# Altium project Twitch_Switch_PCB.PrjPcb (part 2 of 3)

## Sheet Sheet3_Power.SchDoc
size A; SheetNumber: 3; SheetTotal: 6
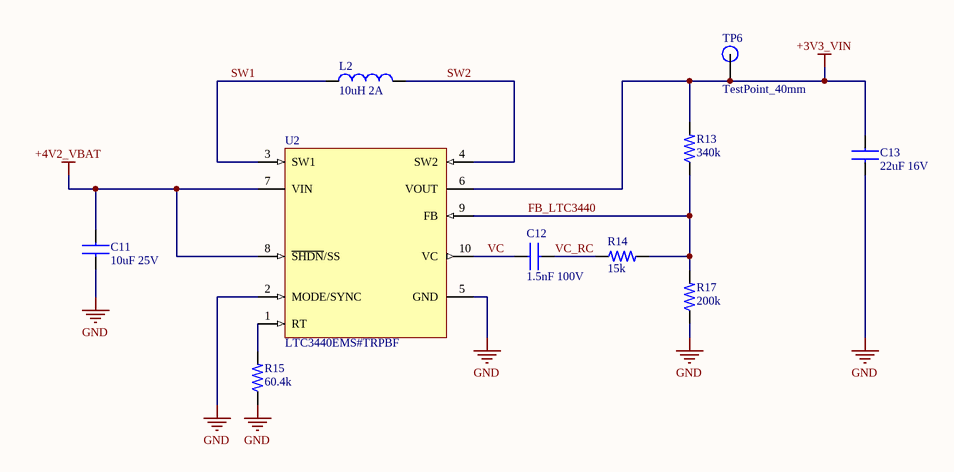
[diagram p1: Sheet3_Power.SchDoc]

### Parts
C11  10uF 25V  [CAP_0805_1_4MM]
C12  1.5nF 100V  [CAP_0805_1_4MM]
C13  22uF 16V  [CAP_0805_1_4MM]
L2  10uH 2A  [IND_4x4MM]
R13  340k  [RES_0603_1608X06]
R14  15k  [RES_0603_1608X06]
R15  60.4k  [RES_0603_1608X06]
R17  200k  [RES_0603_1608X06]
TP6  TestPoint_40mm  [TP_40MM]
U2  LTC3440EMS#TRPBF  [10-MSOP_3x3]

### Nets
+3V3_VIN: C13.1 R13.2 TP6.1 U2.6(VOUT)
+4V2_VBAT: C11.1 U2.7(VIN) U2.8(~{SHDN}/SS)
GND: C11.2 C13.2 R15.1 R17.1 U2.2(MODE/SYNC) U2.5(GND)
FB_LTC3440: R13.1 R14.2 R17.2 U2.9(FB)
SW1: L2.1 U2.3(SW1)
SW2: L2.2 U2.4(SW2)
VC: C12.2 U2.10(VC)
VC_RC: C12.1 R14.1
NetR15_2: R15.2 U2.1(RT)

### Library data of the parts
C11 = GRM21BR61E106KA73K: CAP CER 10UF 25V X5R 0805; Manufacturer: Murata; Tolerance: 10%; Supplier 1: Digi-Key; Manufacturer Part Number: GRM21BR61E106KA73K; RoHS: Yes; Category: Ceramic Capacitors; Stock 1: 101639; Pricing 1: 1=0.23000, 10=0.15700, 50=0.09400, 100=0.07940, 500=0.05434, 1000=0.04807, 2500=0.04598, 5000=0.04180 (USD); Mount: Surface Mount; Case/Package: 0805; Weight: 0.000335oz; Min Operating Temperature: -55°C; Max Operating Temperature: 85°C; Packaging: Tape and Reel; Capacitance: 10uF; Voltage Rating: 25V; Package Quantity: 10000; Dielectric: X5R; Voltage Rating (DC): 25V; Length: 0.079inch; Width: 0.049inch; Thickness: 0.055inch; RoHS Compliant: Yes; ComponentLink1URL: http://www.mouser.com/ds/2/281/c02e-2905.pdf?src-supplier=Mouser; ComponentLink1Description: http://www.mouser.com/ds/2/281/c02e-2905.pdf?src-supplier=Mouser; ComponentLink2URL: http://search.murata.co.jp/Ceramy/image/img/A01X/G101/ENG/GRM21BR61E106KA73-01.pdf?src-supplier=Digi-Key; ComponentLink2Description: http://search.murata.co.jp/Ceramy/image/img/A01X/G101/ENG/GRM21BR61E106KA73-01.pdf?src-supplier=Digi-Key; ComponentLink3URL: https://search.murata.co.jp/Ceramy/image/img/A01X/G101/ENG/GRM21BR61E106KA73-01.pdf?src-supplier=Digi-Key; ComponentLink3Description: https://search.murata.co.jp/Ceramy/image/img/A01X/G101/ENG/GRM21BR61E106KA73-01.pdf?src-supplier=Digi-Key
C12 = C0805C152J1RECAUTO: Cap Cer 0805 1.5NF 100V X7R 5%
C13 = CL21A226MOCLRNC: CAP CER 22UF 16V X5R 0805; Manufacturer: Samsung; Tolerance: 20%; Supplier 1: Digi-Key; Manufacturer Part Number: CL21A226MOCLRNC; RoHS: Yes; Category: Ceramic Capacitors; Stock 1: 182418; Pricing 1: 1=0.35000, 10=0.23900, 50=0.15920, 100=0.13540, 500=0.09554, 1000=0.08360 (USD); Mount: Surface Mount; Case/Package: 0805; Case Code (Metric): 2012; Case Code (Imperial): 0805; Min Operating Temperature: -55°C; Max Operating Temperature: 85°C; Packaging: Tape and Reel; Capacitance: 22uF; Voltage Rating: 16V; Length: 0.079inch; Width: 0.049inch; Thickness: 0.037inch; ComponentLink1URL: http://www.samsungsem.com/kr/support/product-search/mlcc/CL21A226MOCLRNC.jsp?src-supplier=Digi-Key; ComponentLink1Description: http://www.samsungsem.com/kr/support/product-search/mlcc/CL21A226MOCLRNC.jsp?src-supplier=Digi-Key
L2 = TYA4020100M-10: FIXED IND 10UH 2A 220 MOHM SMD; Manufacturer: Laird; Supplier 1: Digi-Key; Manufacturer Part Number: TYA4020100M-10; RoHS: No
R13 = CRCW0603340KFKEA: VISHAY - CRCW0603340KFKEA - SMD Chip Resistor, 0603 [1608 Metric], 340 kohm, CRCW e3 Series, 75 V, Thick Film, 100 mW; Resistance: 340kR; Tolerance: 1%; Temperature Coefficient: 100ppm/°C; Max Power Dissipation: 100mW; Voltage Rating: 75V; Supplier 1: Digi-Key; Manufacturer: Vishay; Manufacturer Part Number: CRCW0603340KFKEA; RoHS: Yes; Category: Chip SMD Resistors; Stock 1: 9256; Pricing 1: 1=0.10000, 10=0.03400, 100=0.01390, 1000=0.00624, 2500=0.00542 (USD); Case/Package: 0603; Number of Pins: 2; Weight: 7.1E-05oz; Case Code (Metric): 1608; Case Code (Imperial): 0603; Contact Plating: Tin; Size Code: 0603; Min Operating Temperature: -55°C; Max Operating Temperature: 155°C; Packaging: Tape and Reel; Package Quantity: 10; Resistor Type: Thick Film; Number of Terminations: 2; Features: Automotive AEC-Q200; Series: CRCW; Power Rating: 100mW; Termination: SMD/SMT; Voltage Rating (DC): 75V; Resistance Tolerance: 1%; Construction: Rectangular; Length: 1.55mm; Width: 0.033inch; Height: 0.02inch; Depth: 0.85mm; Radiation Hardening: No; Lead Free: Lead Free; RoHS Compliant: Yes; REACH SVHC: Unknown; Military Standard: Not; ComponentLink1URL: https://datasheet.ciiva.com/2466/dcrcwe3-2466626.pdf?src-supplier=Digi-Key; ComponentLink1Description: https://datasheet.ciiva.com/2466/dcrcwe3-2466626.pdf?src-supplier=Digi-Key; ComponentLink2URL: https://datasheet.ciiva.com/2466/dcrcwe3-2466627.pdf?src-supplier=Digi-Key; ComponentLink2Description: https://datasheet.ciiva.com/2466/dcrcwe3-2466627.pdf?src-supplier=Digi-Key; ComponentLink3URL: https://datasheet.ciiva.com/2466/dcrcwe3-2466628.pdf?src-supplier=Digi-Key; ComponentLink3Description: https://datasheet.ciiva.com/2466/dcrcwe3-2466628.pdf?src-supplier=Digi-Key; ComponentLink4URL: https://datasheet.ciiva.com/3257/dcrcwe3-3257477.pdf?src-supplier=Avnet; ComponentLink4Description: https://datasheet.ciiva.com/3257/dcrcwe3-3257477.pdf?src-supplier=Avnet; ComponentLink5URL: https://datasheet.ciiva.com/7674/1697337-7674078.pdf?src-supplier=Element14; ComponentLink5Description: https://datasheet.ciiva.com/7674/1697337-7674078.pdf?src-supplier=Element14; ComponentLink6URL: https://datasheet.ciiva.com/5548/dcrcwe3-109170-5548476.pdf?src-supplier=Mouser; ComponentLink6Description: https://datasheet.ciiva.com/5548/dcrcwe3-109170-5548476.pdf?src-supplier=Mouser; ComponentLink7URL: https://datasheet.ciiva.com/7674/1697337-7674079.pdf?src-supplier=Element14; ComponentLink7Description: https://datasheet.ciiva.com/7674/1697337-7674079.pdf?src-supplier=Element14
R14 = RMCF0603JG15K0: SWITCH SLIDE DIP SPST 50MA 24V; Manufacturer: Stackpole Electronics; Resistance: 15kR; Tolerance: 5%; Max Power Dissipation: 100mW; Temperature Coefficient: 200ppm/°C; Body Material: Plastic; Number of Positions: 2; Electrical Life: 10000Cycles; Actuator Type: Slide (Standard); Pitch: 0.1inch; Washable: No; Supplier 1: Digi-Key; Manufacturer Part Number: RMCF0603JG15K0; RoHS: Yes; Category: Chip SMD Resistors; Stock 1: 51631; Pricing 1: 1=0.10000, 10=0.01400, 100=0.00580, 1000=0.00262, 2500=0.00228, 5000=0.00188 (USD); Mount: Surface Mount; Case/Package: 0603; Case Code (Metric): 1608; Case Code (Imperial): 0603; Contact Plating: Tin,Matte; Min Operating Temperature: -55°C; Max Operating Temperature: 155°C; Package Quantity: 1; Packaging: Tape and Reel; Resistor Type: Thick Film; Number of Terminations: 2; Features: Automotive AEC-Q200; Series: RMCF; Length: 0.061inch; Width: 0.031inch; Height: 0.022inch; Radiation Hardening: No; RoHS Compliant: Yes; ComponentLink1URL: https://www.seielect.com/catalog/SEI-Packaging.pdf?src-supplier=Digi-Key; ComponentLink1Description: https://www.seielect.com/catalog/SEI-Packaging.pdf?src-supplier=Digi-Key; ComponentLink2URL: https://www.seielect.com/catalog/SEI-RMCF_RMCP.pdf?src-supplier=Avnet; ComponentLink2Description: https://www.seielect.com/catalog/SEI-RMCF_RMCP.pdf?src-supplier=Avnet; Supplier 2: Digi-Key; Stock 2: 7650; Pricing 2: 1=0.74000, 10=0.71500, 25=0.68760, 100=0.59680, 250=0.54452, 500=0.50600, 1000=0.45375, 2500=0.42625, 5000=0.39600 (USD); Contact Material: Copper Alloy; Max Current Rating: 50mA; Throw Configuration: SPST; Current Rating: 50mA; Voltage Rating (DC): 24V; Termination: PC Pin; Orientation: Straight; Terminal Pitch: 2.54mm; Depth: 9.78mm; Lead Free: Lead Free; ComponentLink3URL: https://datasheet.ciiva.com/16370/206-208-16370206.pdf?src-supplier=Future+Electronics; ComponentLink3Description: https://datasheet.ciiva.com/16370/206-208-16370206.pdf?src-supplier=Future+Electronics; ComponentLink4URL: https://datasheet.ciiva.com/2863/206-208-2863487.pdf?src-supplier=Digi-Key; ComponentLink4Description: https://datasheet.ciiva.com/2863/206-208-2863487.pdf?src-supplier=Digi-Key
R15 = RMCF0603FT60K4: Res Thick Film 0603 60.4K Ohm 1% 1/10W 100ppm/C Molded SMD SMD Paper T/R; Manufacturer: Stackpole Electronics; Resistance: 60.4kR; Max Power Dissipation: 100mW; Temperature Coefficient: 100ppm/°C; Supplier 1: Digi-Key; Manufacturer Part Number: RMCF0603FT60K4; RoHS: Yes; Category: Chip SMD Resistors; Stock 1: 81528; Pricing 1: 1=0.10000, 10=0.01600, 100=0.00650, 1000=0.00292, 2500=0.00253 (USD); Mount: Surface Mount; Case/Package: 0603; Case Code (Metric): 1608; Case Code (Imperial): 0603; Contact Plating: Tin,Matte; Min Operating Temperature: -55°C; Max Operating Temperature: 155°C; Packaging: Tape and Reel; Tolerance: 1%; Resistor Type: Thick Film; Number of Terminations: 2; Features: Automotive AEC-Q200; Series: RMCF; Construction: Rectangular; Length: 1.55mm; Width: 0.031inch; Height: 0.022inch; Depth: 0.8mm; Radiation Hardening: No; Military Standard: Not; RoHS Compliant: Yes; ComponentLink1URL: http://components.arrow.com/part/dataview/47797003S7054871N1174?src-supplier=Arrow+Electronics; ComponentLink1Description: http://components.arrow.com/part/dataview/47797003S7054871N1174?src-supplier=Arrow+Electronics; ComponentLink2URL: https://www.verical.com/server-webapp/html/getDatasheet?partID=493745&src-supplier=Verical; ComponentLink2Description: https://www.verical.com/server-webapp/html/getDatasheet?partID=493745&src-supplier=Verical; ComponentLink3URL: https://www.seielect.com/catalog/SEI-RMCF_RMCP.pdf?src-supplier=Avnet; ComponentLink3Description: https://www.seielect.com/catalog/SEI-RMCF_RMCP.pdf?src-supplier=Avnet; ComponentLink4URL: https://www.seielect.com/Catalog/SEI-RMCF_RMCP.pdf?src-supplier=Digi-Key; ComponentLink4Description: https://www.seielect.com/Catalog/SEI-RMCF_RMCP.pdf?src-supplier=Digi-Key; ComponentLink5URL: https://www.seielect.com/catalog/SEI-Packaging.pdf?src-supplier=Digi-Key; ComponentLink5Description: https://www.seielect.com/catalog/SEI-Packaging.pdf?src-supplier=Digi-Key; ComponentLink6URL: https://www.seielect.com/catalog/SEI-RMCF_RMCP.pdf?src-supplier=Avnet+Asia; ComponentLink6Description: https://www.seielect.com/catalog/SEI-RMCF_RMCP.pdf?src-supplier=Avnet+Asia
R17 = CRCW0603200KFKEA: VISHAY - CRCW0603200KFKEA - SMD Chip Resistor, 0603 [1608 Metric], 200 kohm, CRCW e3 Series, 75 V, Thick Film, 100 mW; Tolerance: 1%; Resistance: 200kR; Temperature Coefficient: 100ppm/°C; Power Rating: 100mW; Voltage Rating: 75V; Supplier 1: Avnet; Manufacturer: Vishay; Manufacturer Part Number: CRCW0603200KFKEA; RoHS: Yes; Category: Chip SMD Resistors; Stock 1: 660000; Pricing 1: 5000=0.00192, 10000=0.00189, 20000=0.00184, 30000=0.00180, 40000=0.00173, 50000=0.00169, 500000=0.00165 (USD); Mount: Surface Mount; Case/Package: 0603; Contact Plating: Tin; Weight: 7.1E-05oz; Case Code (Metric): 1608; Case Code (Imperial): 0603; Min Operating Temperature: -55°C; Max Operating Temperature: 155°C; Resistor Type: Thick Film; Packaging: Tape and Reel; Package Quantity: 10; Number of Terminations: 2; Termination: SMD/SMT; Max Power Dissipation: 100mW; Features: Automotive AEC-Q200; Series: CRCW; Construction: Rectangular; Voltage Rating (DC): 75V; Working Voltage: 75V; Technology: THICK FILM; Resistance Tolerance: 1%; Length: 1.55mm; Width: 0.033inch; Height: 0.45mm; Depth: 0.85mm; Radiation Hardening: No; Lead Free: Lead Free; RoHS Compliant: Yes; Military Standard: Not; REACH SVHC: Unknown; ComponentLink1URL: https://datasheet.ciiva.com/11808/0900766b80d98afc-11808389.pdf?src-supplier=RSComponents; ComponentLink1Description: https://datasheet.ciiva.com/11808/0900766b80d98afc-11808389.pdf?src-supplier=RSComponents; ComponentLink2URL: https://datasheet.ciiva.com/2465/dcrcwe3-2465731.pdf?src-supplier=Digi-Key; ComponentLink2Description: https://datasheet.ciiva.com/2465/dcrcwe3-2465731.pdf?src-supplier=Digi-Key; ComponentLink3URL: https://datasheet.ciiva.com/16199/dcrcwe3-16199205.pdf?src-supplier=Future+Electronics; ComponentLink3Description: https://datasheet.ciiva.com/16199/dcrcwe3-16199205.pdf?src-supplier=Future+Electronics; ComponentLink4URL: https://datasheet.ciiva.com/7714/1697337-7714246.pdf?src-supplier=Element14; ComponentLink4Description: https://datasheet.ciiva.com/7714/1697337-7714246.pdf?src-supplier=Element14; ComponentLink5URL: https://datasheet.ciiva.com/3257/dcrcwe3-3257230.pdf?src-supplier=Avnet; ComponentLink5Description: https://datasheet.ciiva.com/3257/dcrcwe3-3257230.pdf?src-supplier=Avnet; ComponentLink6URL: https://datasheet.ciiva.com/3257/dcrcwe3-3257231.pdf?src-supplier=Avnet; ComponentLink6Description: https://datasheet.ciiva.com/3257/dcrcwe3-3257231.pdf?src-supplier=Avnet; ComponentLink7URL: https://datasheet.ciiva.com/2465/dcrcwe3-2465729.pdf?src-supplier=Digi-Key; ComponentLink7Description: https://datasheet.ciiva.com/2465/dcrcwe3-2465729.pdf?src-supplier=Digi-Key; ComponentLink8URL: https://datasheet.ciiva.com/2465/dcrcwe3-2465730.pdf?src-supplier=Digi-Key; ComponentLink8Description: https://datasheet.ciiva.com/2465/dcrcwe3-2465730.pdf?src-supplier=Digi-Key; ComponentLink9URL: https://datasheet.ciiva.com/5546/dcrcwe3-109170-5546041.pdf?src-supplier=Mouser; ComponentLink9Description: https://datasheet.ciiva.com/5546/dcrcwe3-109170-5546041.pdf?src-supplier=Mouser; ComponentLink10URL: https://datasheet.ciiva.com/16893/dcrcwe3-16893833.pdf?src-supplier=Avnet+Europe; ComponentLink10Description: https://datasheet.ciiva.com/16893/dcrcwe3-16893833.pdf?src-supplier=Avnet+Europe
U2 = LTC3440EMS#TRPBF: IC REG BUCK BST ADJ 0.6A 10MSOP; Manufacturer: Analog Devices / Linear Technology; Output Voltage: 5.5V; Output Current: 600mA; Efficiency: 96%; Min Input Voltage: 2.5V; Number of Outputs: 1; Switching Frequency: 2MHz; Synchronous Rectifier: Yes; Output Type: Adjustable; Supplier 1: Digi-Key; Manufacturer Part Number: LTC3440EMS#TRPBF; RoHS: Yes; Category: Voltage Regulators - Switching; Stock 1: 8435; Pricing 1: 1=6.71000, 10=6.06200, 25=5.78000, 100=4.79330, 250=4.37040, 500=4.08842, 1000=3.72400 (USD); Case/Package: MSOP; Number of Pins: 10; Min Operating Temperature: -40°C; Max Operating Temperature: 85°C; Package Quantity: 2500; Packaging: Tape and Reel; Series: -; Lead Free: Lead Free; RoHS Compliant: Yes; ComponentLink1URL: https://datasheet.ciiva.com/26899/ltc3440ems-trpbf-26899120.pdf?src-supplier=IIIC; ComponentLink1Description: https://datasheet.ciiva.com/26899/ltc3440ems-trpbf-26899120.pdf?src-supplier=IIIC; ComponentLink2URL: https://datasheet.ciiva.com/2031/3314-2031816.pdf?src-supplier=Digi-Key; ComponentLink2Description: https://datasheet.ciiva.com/2031/3314-2031816.pdf?src-supplier=Digi-Key

## Sheet Sheet4_MCU_Sensors.SchDoc
size A; SheetNumber: 4; SheetTotal: 6
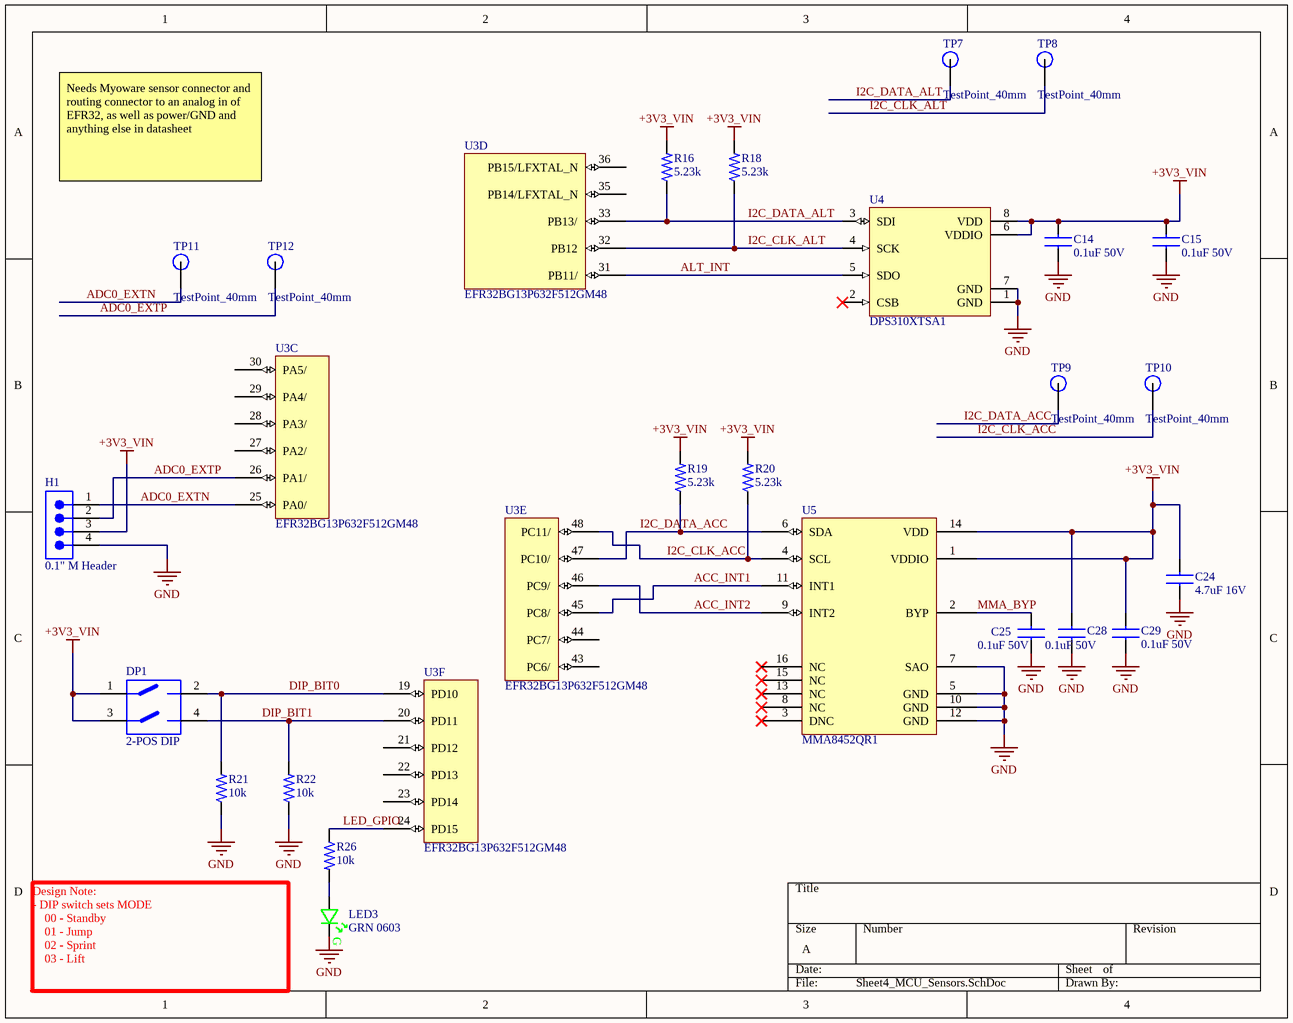
[diagram p2: Sheet4_MCU_Sensors.SchDoc]

### Parts
C14  0.1uF 50V  [CAP_0603_1MM]
C15  0.1uF 50V  [CAP_0603_1MM]
C24  4.7uF 16V  [CAP_0805_1_4MM]
C25  0.1uF 50V  [CAP_0603_1MM]
C28  0.1uF 50V  [CAP_0603_1MM]
C29  0.1uF 50V  [CAP_0603_1MM]
DP1  2-POS DIP  [4-PIN_DIP_2.54MM]
H1  0.1" M Header  [4-PIN_MALE_HEADER_01-IN]
LED3  GRN 0603  [LED_0603_GRN_WL-SMCW]
R16  5.23k  [RES_0603_1608X06]
R18  5.23k  [RES_0603_1608X06]
R19  5.23k  [RES_0603_1608X06]
R20  5.23k  [RES_0603_1608X06]
R21  10k  [RES_0805_2X1_25MM]
R22  10k  [RES_0805_2X1_25MM]
R26  10k  [RES_0805_2X1_25MM]
TP7  TestPoint_40mm  [TP_40MM]
TP8  TestPoint_40mm  [TP_40MM]
TP9  TestPoint_40mm  [TP_40MM]
TP10  TestPoint_40mm  [TP_40MM]
TP11  TestPoint_40mm  [TP_40MM]
TP12  TestPoint_40mm  [TP_40MM]
U3  EFR32BG13P632F512GM48  [QFN50P700X700X90_HS-49N]  (parts C,D,E,F of 7)
U4  DPS310XTSA1  [8-VLGA_2x2_5x1]
U5  MMA8452QR1  [MMA8452]

### Nets
+3V3_VIN: C14.1 C15.1 C24.2 C28.1 C29.1 DP1.1 DP1.3 H1.3 R16.2 R18.2 R19.2 R20.2 U4.6(VDDIO) U4.8(VDD) U5.1(VDDIO) U5.14(VDD)
GND: C14.2 C15.2 C24.1 C25.2 C28.2 C29.2 H1.4 LED3.C R21.1 R22.1 U4.1(GND) U4.7(GND) U5.5(GND) U5.7(SAO) U5.10(GND) U5.12(GND)
ACC_INT1: U3.45(PC8/) U5.11(INT1)
ACC_INT2: U3.46(PC9/) U5.9(INT2)
ADC0_EXTN: H1.1 TP11.1 U3.25(PA0/)
ADC0_EXTP: H1.2 TP12.1 U3.26(PA1/)
ALT_INT: U3.31(PB11/) U4.5(SDO)
DIP_BIT0: DP1.2 R21.2 U3.19(PD10)
DIP_BIT1: DP1.4 R22.2 U3.20(PD11)
I2C_CLK_ACC: R20.1 TP10.1 U3.48(PC11/) U5.4(SCL)
I2C_CLK_ALT: R18.1 TP8.1 U3.32(PB12) U4.4(SCK)
I2C_DATA_ACC: R19.1 TP9.1 U3.47(PC10/) U5.6(SDA)
I2C_DATA_ALT: R16.1 TP7.1 U3.33(PB13/) U4.3(SDI)
LED_GPIO: R26.1 U3.24(PD15)
MMA_BYP: C25.1 U5.2(BYP)
NetLED3_A: LED3.A R26.2

Not connected (* = marked no-connect by the designer): U3 21(PD12) 22(PD13) 23(PD14) 27(PA2/) 28(PA3/) 29(PA4/) 30(PA5/) 35(PB14/LFXTAL_N) 36(PB15/LFXTAL_N) 43(PC6/) 44(PC7/); U4 2(CSB)*; U5 3(DNC)* 8(NC)* 13(NC)* 15(NC)* 16(NC)*

### Notes on the sheet
- Needs Myoware sensor connector and routing connector to an analog in of EFR32, as well as power/GND and anything else in datasheet
- Design Note:
  - DIP switch sets MODE
  00 - Standby
  01 - Jump
  02 - Sprint
  03 - Lift
- (in symbol 150060GS75000) G

### Library data of the parts
C14 C15 C25 C28 C29 = CC0603KRX7R9BB104: CAPACITOR CERAMIC, 0.1UF, 50V, X7R, 10%, 0603; Manufacturer: Yageo; Capacitance: 100nF; Supplier 1: Digi-Key; Manufacturer Part Number: CC0603KRX7R9BB104; RoHS: Yes; Category: Ceramic Capacitors; Stock 1: 8863982; Pricing 1: 1=0.10000, 10=0.05900, 50=0.03240, 100=0.02640, 500=0.01886, 1000=0.01482 (USD); Mount: Surface Mount; Case/Package: 0603; Number of Pins: 2; Case Code (Metric): 1608; Case Code (Imperial): 0603; Dielectric Material: Ceramic; Min Operating Temperature: -55°C; Max Operating Temperature: 125°C; Package Quantity: 1; Voltage Rating: 50V; Tolerance: 10%; Packaging: Tape and Reel; Dielectric: X7R; Termination: SMD/SMT; Voltage: 50V; Series: CC; Length: 1.6mm; Width: 0.031inch; Height: 0.8mm; Thickness: 0.035inch; Depth: 0.8mm; Radiation Hardening: No; REACH SVHC: No SVHC; Lead Free: Lead Free; Halogen Free: Halogen Free; RoHS Compliant: Yes; ComponentLink1URL: https://datasheet.ciiva.com/11786/0900766b80d84f1d-11786061.pdf?src-supplier=RSComponents; ComponentLink1Description: https://datasheet.ciiva.com/11786/0900766b80d84f1d-11786061.pdf?src-supplier=RSComponents; ComponentLink2URL: https://datasheet.ciiva.com/144/mlccorderingcode-144176.pdf?src-supplier=Digi-Key; ComponentLink2Description: https://datasheet.ciiva.com/144/mlccorderingcode-144176.pdf?src-supplier=Digi-Key; ComponentLink3URL: https://datasheet.ciiva.com/144/mlccorderingcode-144177.pdf?src-supplier=Digi-Key; ComponentLink3Description: https://datasheet.ciiva.com/144/mlccorderingcode-144177.pdf?src-supplier=Digi-Key; ComponentLink4URL: https://datasheet.ciiva.com/144/mlccorderingcode-144178.pdf?src-supplier=Digi-Key; ComponentLink4Description: https://datasheet.ciiva.com/144/mlccorderingcode-144178.pdf?src-supplier=Digi-Key; ComponentLink5URL: https://datasheet.ciiva.com/31394/1489800-31394927.pdf?src-supplier=Farnell; ComponentLink5Description: https://datasheet.ciiva.com/31394/1489800-31394927.pdf?src-supplier=Farnell; ComponentLink6URL: https://datasheet.ciiva.com/8033/70765-8033819.pdf?src-supplier=Element14; ComponentLink6Description: https://datasheet.ciiva.com/8033/70765-8033819.pdf?src-supplier=Element14; ComponentLink7URL: https://datasheet.ciiva.com/8033/70765-8033821.pdf?src-supplier=Element14; ComponentLink7Description: https://datasheet.ciiva.com/8033/70765-8033821.pdf?src-supplier=Element14; ComponentLink8URL: https://datasheet.ciiva.com/22749/1489800-22749214.pdf?src-supplier=Element14; ComponentLink8Description: https://datasheet.ciiva.com/22749/1489800-22749214.pdf?src-supplier=Element14; ComponentLink9URL: https://datasheet.ciiva.com/7978/1489800-7978166.pdf?src-supplier=Element14; ComponentLink9Description: https://datasheet.ciiva.com/7978/1489800-7978166.pdf?src-supplier=Element14; ComponentLink10URL: https://datasheet.ciiva.com/16625/upy-gphc-x7r-6-3v-to-50v-8-16625530.pdf?src-supplier=Avnet+Europe; ComponentLink10Description: https://datasheet.ciiva.com/16625/upy-gphc-x7r-6-3v-to-50v-8-16625530.pdf?src-supplier=Avnet+Europe
C24 = CL21A475KOFNNNG: CAP CER 4.7UF 16V X5R 0805; Manufacturer: Samsung; Material: Ceramic; Tolerance: 10%; Supplier 1: Digi-Key; Manufacturer Part Number: CL21A475KOFNNNG; RoHS: Yes; Category: Ceramic Capacitors; Stock 1: 18827; Pricing 1: 1=0.12000, 10=0.08800, 50=0.05000, 100=0.04140, 500=0.02906, 1000=0.02405 (USD); Mount: Surface Mount; Case/Package: 0805; Case Code (Metric): 2012; Case Code (Imperial): 0805; Min Operating Temperature: -55°C; Max Operating Temperature: 85°C; Capacitance: 4.7uF; Package Quantity: 3000; Packaging: Tape and Reel; Voltage Rating: 16V; Dielectric: X5R; Voltage: 16V; Series: CL; Length: 2mm; Width: 0.049inch; Height: 1.25mm; Thickness: 0.053inch; Depth: 1.25mm; Lead Free: Lead Free; RoHS Compliant: Yes; ComponentLink1URL: https://datasheet.ciiva.com/25731/cl21a475kofnnng-25731814.pdf?src-supplier=Digi-Key; ComponentLink1Description: https://datasheet.ciiva.com/25731/cl21a475kofnnng-25731814.pdf?src-supplier=Digi-Key; ComponentLink2URL: https://datasheet.ciiva.com/29199/455276-da-01-en-vs-kondensator-0805-29199361.pdf?src-supplier=Conrad; ComponentLink2Description: https://datasheet.ciiva.com/29199/455276-da-01-en-vs-kondensator-0805-29199361.pdf?src-supplier=Conrad; ComponentLink3URL: https://datasheet.ciiva.com/26310/mlcc-catalogdownload2013-eng-26310158.pdf?src-supplier=Distrelec; ComponentLink3Description: https://datasheet.ciiva.com/26310/mlcc-catalogdownload2013-eng-26310158.pdf?src-supplier=Distrelec; ComponentLink4URL: https://datasheet.ciiva.com/16428/cl05b104kq5nnnc-16428879.pdf?src-supplier=Future+Electronics; ComponentLink4Description: https://datasheet.ciiva.com/16428/cl05b104kq5nnnc-16428879.pdf?src-supplier=Future+Electronics
DP1 = 206-2: SWITCH SLIDE DIP SPST 50MA 24V
H1 = PRPC004SAAN-RC: CONN HEADER VERT 4POS 2.54MM; Manufacturer: Sullins; Connector Type: Header, Unshrouded, Breakaway; Number of Positions: 4; Number of Positions Loaded: All; Pitch: 0.100" (2.54mm); Online Catalog: 0.100" (2.54mm) Pitch Connector Headers; Other Names: S9510E-04  S9510E-04-ND; Supplier 1: Digi-Key; Manufacturer Part Number: PRPC004SAAN-RC; Stock 1: 6306; Pricing 1: 1=0.15, 10=0.146, 25=0.1084, 50=0.0928, 100=0.0898, 250=0.0774, 500=0.0743 (USD); Standard Package: 1; Category: Connectors, Interconnects; Family: Rectangular Connectors - Headers, Male Pins; Series: -; Packaging: Bulk; Contact Type: Male Pin; Number of Rows: 1; Row Spacing: -; Contact Mating Length: 0.230" (5.84mm); Mounting Type: Through Hole; Termination: Solder; Fastening Type: -; Features: -; Contact Finish: Gold; Contact Finish Thickness: Flash; Color: Black; ComponentLink1URL: https://media.digikey.com/PDF/Data%20Sheets/Sullins%20PDFs/xRxCzzzSxxN-RC_ST_11635-B.pdf?src-supplier=Digi-Key; ComponentLink1Description: https://media.digikey.com/PDF/Data%20Sheets/Sullins%20PDFs/xRxCzzzSxxN-RC_ST_11635-B.pdf?src-supplier=Digi-Key; Supplier Part Number 1: S1011EC-04-ND
LED3 = 150060GS75000: LED, 0603, GREEN, 430MCD, 520NM; Manufacturer: Wurth Electronics; Dynamic Catalog: 0603 Rectangle with Flat Top Chip LEDs; 3D Model: SMCW_0603.igs / SMCW_0603.stp / SMCW_0603.wrl; Wavelength - Peak: 515nm; Voltage - Forward (Vf) (Typ): 3.2V; Current - Test: 20mA; Viewing Angle: 140°; Lens Type: Clear; Lens Style/Size: Rectangle with Flat Top, 1.1mm x 0.7mm; Other Names: 732-4971-2; Supplier 1: Digi-Key; Manufacturer Part Number: 150060GS75000; Stock 1: 34964; Pricing 1: 1=0.14, 50=0.129, 100=0.11, 500=0.095 (USD); Standard Package: 4,000; Category: Optoelectronics; Family: LED Indication - Discrete; Series: WL-SMCW; Packaging: Tape & Reel (TR); Color: Green; Wavelength - Dominant: 520nm; Millicandela Rating: 430mcd; Package / Case: 0603 (1608 Metric); Size / Dimension: 1.60mm L x 0.80mm W; Height: 0.70mm; Mounting Type: Surface Mount; Online Catalog: 0603 Rectangle with Flat Top Chip LEDs; ComponentLink1URL: https://katalog.we-online.de/led/datasheet/150060GS75000.pdf?src-supplier=Digi-Key; ComponentLink1Description: https://katalog.we-online.de/led/datasheet/150060GS75000.pdf?src-supplier=Digi-Key; ComponentLink2URL: http://www.produktinfo.conrad.com/datenblaetter/750000-774999/759427-da-01-en-CHIPLED_0603_W_KL_GRUEN_150060GS75000.pdf?src-supplier=Conrad; ComponentLink2Description: http://www.produktinfo.conrad.com/datenblaetter/750000-774999/759427-da-01-en-CHIPLED_0603_W_KL_GRUEN_150060GS75000.pdf?src-supplier=Conrad; Supplier Part Number 1: 732-4971-1-ND
R16 R18-R20 = RMCF0603FT5K23: RES SMD 5.23K OHM 1% 1/10W 0603; Manufacturer: Stackpole Electronics; Resistance: 5.23kR; Max Power Dissipation: 100mW; Temperature Coefficient: 100ppm/°C; Supplier 1: Digi-Key; Manufacturer Part Number: RMCF0603FT5K23; RoHS: Yes; Category: Chip SMD Resistors; Stock 1: 29980; Pricing 1: 1=0.10000, 10=0.01600, 100=0.00650, 1000=0.00292, 2500=0.00253 (USD); Mount: Surface Mount; Case/Package: 0603; Case Code (Metric): 1608; Case Code (Imperial): 0603; Contact Plating: Tin,Matte; Min Operating Temperature: -55°C; Max Operating Temperature: 155°C; Tolerance: 1%; Features: Automotive AEC-Q200; Packaging: Tape and Reel; Resistor Type: Thick Film; Number of Terminations: 2; Series: RMCF; Length: 0.061inch; Width: 0.031inch; Height: 0.022inch; Radiation Hardening: No; Lead Free: Lead Free; RoHS Compliant: Yes; ComponentLink1URL: https://www.seielect.com/Catalog/SEI-RMCF_RMCP.pdf?src-supplier=Digi-Key; ComponentLink1Description: https://www.seielect.com/Catalog/SEI-RMCF_RMCP.pdf?src-supplier=Digi-Key; ComponentLink2URL: https://www.seielect.com/catalog/SEI-Packaging.pdf?src-supplier=Digi-Key; ComponentLink2Description: https://www.seielect.com/catalog/SEI-Packaging.pdf?src-supplier=Digi-Key; ComponentLink3URL: https://www.seielect.com/catalog/SEI-RMCF_RMCP.pdf?src-supplier=Avnet; ComponentLink3Description: https://www.seielect.com/catalog/SEI-RMCF_RMCP.pdf?src-supplier=Avnet
R21 R22 R26 = RMCF0805FT10K0: RES 10K OHM 1% 1/8W 0805; Manufacturer: Stackpole Electronics; Resistance: 10kR; Power Rating: 125mW; Temperature Coefficient: 100ppm/°C; Supplier 1: Digi-Key; Manufacturer Part Number: RMCF0805FT10K0; RoHS: Yes; Category: Chip SMD Resistors; Stock 1: 2466676; Pricing 1: 1=0.10000, 10=0.02600, 100=0.01040, 1000=0.00466, 2500=0.00405 (USD); Mount: Surface Mount; Case/Package: 0805; Case Code (Metric): 2012; Case Code (Imperial): 0805; Contact Plating: Tin,Matte; Size Code: 0805; Min Operating Temperature: -55°C; Max Operating Temperature: 155°C; Tolerance: 1%; Packaging: Tape and Reel; Resistor Type: Thick Film; Number of Terminations: 2; Max Power Dissipation: 125mW; Features: Automotive AEC-Q200; Series: RMCF; Construction: Rectangular; Length: 2mm; Width: 0.049inch; Height: 0.026inch; Depth: 1.25mm; Radiation Hardening: No; Lead Free: Lead Free; Military Standard: Not; RoHS Compliant: Yes; ComponentLink1URL: https://datasheet.ciiva.com/15193/getdatasheetpartid-362046-15193525.pdf?src-supplier=Verical; ComponentLink1Description: https://datasheet.ciiva.com/15193/getdatasheetpartid-362046-15193525.pdf?src-supplier=Verical
U3 = EFR32BG13P732F512GM48-B_1: BLUE PREMIUM QFN48 2.4G 19 DBM B; Manufacturer: Silicon Labs; Interface: I2C,UART,USART; Frequency: 2.4GHz; Data Rate: 2Mbps; Sensitivity: -102dBm; Memory Size: 64KB; Number of GPIO: 31; Current - Receiving: 11mA; Current - Transmitting: 8.5mA; Supplier 1: Digi-Key; Manufacturer Part Number: EFR32BG13P732F512GM48-B; RoHS: Yes; Category: RF Receivers, Transceivers; Stock 1: 19; Pricing 1: 1=6.48000, 25=6.24040, 100=6.00030, 1000=5.98905 (USD); Min Operating Temperature: -40°C; Max Operating Temperature: 85°C; Packaging: Tray; RoHS Compliant: Yes; ComponentLink1URL: https://www.silabs.com/documents/login/data-sheets/efr32bg13-datasheet.pdf?src-supplier=Digi-Key; ComponentLink1Description: https://www.silabs.com/documents/login/data-sheets/efr32bg13-datasheet.pdf?src-supplier=Digi-Key
U4 = DPS310XTSA1: INFINEON - DPS310XTSA1 - Pressure Sensor, Barometric, 17.404 psi, 4.351 psi, 1.7 V, 3.6 V; Interface: I2C,SPI; Max Supply Voltage: 3.6V; Output Type: SPI,I2C; Pressure Type: Vented Gauge; Operating Pressure: 17.4PSI; Max Pressure: 145PSI; Supplier 1: Digi-Key; Manufacturer: Infineon; Manufacturer Part Number: DPS310XTSA1; RoHS: Yes; Category: Pressure Sensors; Stock 1: 17160; Pricing 1: 1=2.89000, 5=2.68200, 10=2.22800, 25=1.85640, 50=1.65000, 100=1.56750, 500=1.32000, 1000=1.23750 (USD); Case/Package: LGA; Number of Pins: 8; Min Operating Temperature: -40°C; Max Operating Temperature: 85°C; Termination: SMD/SMT; Lead Free: Lead Free; Halogen Free: Halogen Free; RoHS Compliant: Yes; ComponentLink1URL: http://www.farnell.com/datasheets/2211517.pdf?src-supplier=Farnell; ComponentLink1Description: http://www.farnell.com/datasheets/2211517.pdf?src-supplier=Farnell; ComponentLink2URL: https://www.infineon.com/dgdl/Infineon-DPS310-DS-v01_00-EN.pdf?fileId=5546d462576f34750157750826c42242&src-supplier=Digi-Key; ComponentLink2Description: https://www.infineon.com/dgdl/Infineon-DPS310-DS-v01_00-EN.pdf?fileId=5546d462576f34750157750826c42242&src-supplier=Digi-Key; ComponentLink3URL: http://www.farnell.com/datasheets/2211517.pdf?src-supplier=Newark; ComponentLink3Description: http://www.farnell.com/datasheets/2211517.pdf?src-supplier=Newark; ComponentLink4URL: http://www.farnell.com/datasheets/2211517.pdf?src-supplier=Element14; ComponentLink4Description: http://www.farnell.com/datasheets/2211517.pdf?src-supplier=Element14
U5 = MMA8452QR1: Accelerometer Triple ±2g/±4g/±8g 2.5V 16-Pin QFN T/R; Manufacturer: NXP Freescale; Bandwidth: 400Hz; Interface: I2C; Max Supply Voltage: 3.6V; Min Supply Voltage: 1.95V; Resolution: 12b; Output Type: I2C,Digital; Axis: X, Y, Z; Supplier 1: Newark; Manufacturer Part Number: MMA8452QR1; RoHS: Yes; Category: Accelerometers; Pricing 1: 1=2.49000, 10=1.57000, 25=1.51000, 50=1.46000, 100=1.40000 (USD); Mount: Surface Mount; Case/Package: QFN; Number of Pins: 16; Weight: 0.001122oz; Contact Plating: Gold; Min Operating Temperature: -40°C; Max Operating Temperature: 85°C; Package Quantity: 1000; Packaging: Tape and Reel; Series: -; Length: 3mm; Depth: 3mm; Radiation Hardening: No; REACH SVHC: No SVHC; RoHS Compliant: Yes; ComponentLink1URL: https://datasheet.ciiva.com/6484/mma8452q-6484545.pdf?src-supplier=Digi-Key; ComponentLink1Description: https://datasheet.ciiva.com/6484/mma8452q-6484545.pdf?src-supplier=Digi-Key; ComponentLink2URL: https://datasheet.ciiva.com/5296/mma8452q-64080-5296451.pdf?src-supplier=Mouser; ComponentLink2Description: https://datasheet.ciiva.com/5296/mma8452q-64080-5296451.pdf?src-supplier=Mouser; ComponentLink3URL: https://datasheet.ciiva.com/26025/mma8452q-26025828.pdf?src-supplier=Avnet+Europe; ComponentLink3Description: https://datasheet.ciiva.com/26025/mma8452q-26025828.pdf?src-supplier=Avnet+Europe; ComponentLink4URL: https://datasheet.ciiva.com/41459/001183459-da-01-en-ic-acceler-2g-4g-8-mma8452qr1-qfn-16-fre-41459457.pdf?src-supplier=Conrad; ComponentLink4Description: https://datasheet.ciiva.com/41459/001183459-da-01-en-ic-acceler-2g-4g-8-mma8452qr1-qfn-16-fre-41459457.pdf?src-supplier=Conrad; ComponentLink5URL: https://datasheet.ciiva.com/6484/mma8452q-6484518.pdf?src-supplier=Digi-Key; ComponentLink5Description: https://datasheet.ciiva.com/6484/mma8452q-6484518.pdf?src-supplier=Digi-Key; ComponentLink6URL: https://datasheet.ciiva.com/6484/mma8452q-6484517.pdf?src-supplier=Digi-Key; ComponentLink6Description: https://datasheet.ciiva.com/6484/mma8452q-6484517.pdf?src-supplier=Digi-Key; ComponentLink7URL: https://datasheet.ciiva.com/3271/mma8452q-3271581.pdf?src-supplier=Avnet; ComponentLink7Description: https://datasheet.ciiva.com/3271/mma8452q-3271581.pdf?src-supplier=Avnet

## Sheet Sheet5_MCU_PowerDecoupling.SchDoc
size A; SheetNumber: 5; SheetTotal: 6
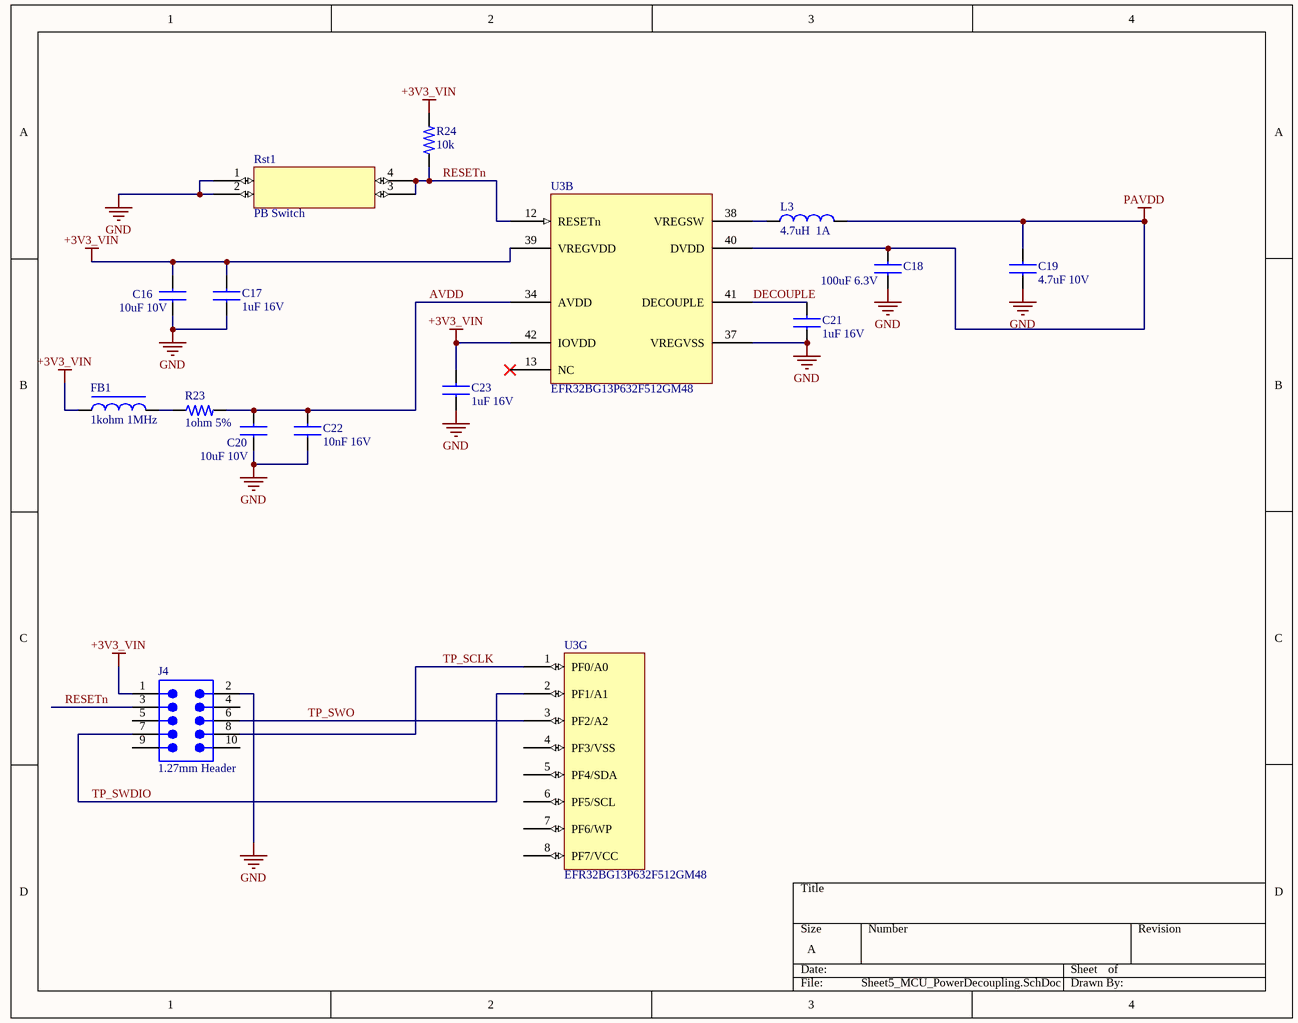
[diagram p3: Sheet5_MCU_PowerDecoupling.SchDoc]

### Parts
C16  10uF 10V  [CAP_0805_1_4MM]
C17  1uF 16V  [CAP_0603_1MM]
C18  100uF 6.3V  [RES_1206_310X16]
C19  4.7uF 10V  [CAP_0603_1MM]
C20  10uF 10V  [CAP_0805_1_4MM]
C21  1uF 16V  [CAP_0603_1MM]
C22  10nF 16V  [CAP_0805_1_4MM]
C23  1uF 16V  [CAP_0603_1MM]
FB1  1kohm 1MHz  [CAP_0603_1MM]
J4  1.27mm Header  [SAMTEC_FTSH-105-XX-X-DV]
L3  4.7uH  1A  [IND_2828x30]
R23  1ohm 5%  [RES_0603_1608X06]
R24  10k  [RES_0805_2X1_25MM]
Rst1  PB Switch  [DFN300P450X290-4N]
U3  EFR32BG13P632F512GM48  [QFN50P700X700X90_HS-49N]  (parts B,G of 7)

### Nets
+3V3_VIN: C16.1 C17.1 C23.1 FB1.1 J4.1 R24.2 U3.39(VREGVDD) U3.42(IOVDD)
GND: C16.2 C17.2 C18.2 C19.2 C20.2 C21.2 C22.2 C23.2 J4.2 Rst1.1(HI_A) Rst1.2(HI_B) U3.37(VREGVSS)
PAVDD: C18.1 C19.1 L3.2 U3.40(DVDD)
AVDD: C20.1 C22.1 R23.2 U3.34(AVDD)
DECOUPLE: C21.1 U3.41(DECOUPLE)
RESETn: J4.3 R24.1 Rst1.3(LO_A) Rst1.4(LO_B) U3.12(RESETn)
TP_SCLK: J4.8 U3.1(PF0/A0)
TP_SWDIO: J4.7 U3.2(PF1/A1)
TP_SWO: J4.6 U3.3(PF2/A2)
NetFB1_2: FB1.2 R23.1
NetL3_1: L3.1 U3.38(VREGSW)

Not connected (* = marked no-connect by the designer): J4 4 5 9 10; U3 4(PF3/VSS) 5(PF4/SDA) 6(PF5/SCL) 7(PF6/WP) 8(PF7/VCC) 13(NC)*

### Library data of the parts
C16 C20 = C0805C106K8PACTU: CAP CER 10UF 10V X5R 0805; Manufacturer: KEMET; Dielectric Material: Ceramic; Tolerance: 10%; Supplier 1: Digi-Key; Manufacturer Part Number: C0805C106K8PACTU; RoHS: Yes; Category: Ceramic Capacitors; Stock 1: 936862; Pricing 1: 1=0.14000, 10=0.10200, 50=0.05780, 100=0.04780, 500=0.03356, 1000=0.02778 (USD); Mount: Surface Mount; Case/Package: 0805; Number of Pins: 2; Contact Plating: Tin,Matte; Case Code (Imperial): 0805; Case Code (Metric): 2012; Min Operating Temperature: -55°C; Max Operating Temperature: 85°C; Capacitance: 10uF; Packaging: Tape and Reel; Dielectric: X5R; Voltage Rating (DC): 10V; Termination: SMD/SMT; Package Quantity: 1; Voltage Rating: 10V; Voltage: 10V; Dissipation Factor: 10%; Series: C; Construction: Flat; Length: 2mm; Width: 1.2mm; Height: 1.25mm; Depth: 1.25mm; Thickness: 0.055inch; Radiation Hardening: No; REACH SVHC: No SVHC; RoHS Compliant: Yes; ComponentLink1URL: https://datasheet.ciiva.com/7842/1732709-7842198.pdf?src-supplier=Element14; ComponentLink1Description: https://datasheet.ciiva.com/7842/1732709-7842198.pdf?src-supplier=Element14; ComponentLink2URL: https://datasheet.ciiva.com/7842/40889-7842552.pdf?src-supplier=Element14; ComponentLink2Description: https://datasheet.ciiva.com/7842/40889-7842552.pdf?src-supplier=Element14; ComponentLink3URL: https://datasheet.ciiva.com/22704/1732709-22704859.pdf?src-supplier=Element14; ComponentLink3Description: https://datasheet.ciiva.com/22704/1732709-22704859.pdf?src-supplier=Element14
C17 C21 C23 = C0603C105K4RAC7411: KEMET - C0603C105K4RAC7411 - Condensatore Ceramico Multistrato SMD, 1 µF, 16 V, 0603 [1608 Metrico], ± 10%, X7R, Serie C KEMET; Supplier 1: Digi-Key; Manufacturer: KEMET; Manufacturer Part Number: C0603C105K4RAC7411; RoHS: Yes; Category: Capacitors; Stock 1: 34224; Pricing 1: 1=0.10000, 10=0.07600, 50=0.04160, 100=0.03400, 500=0.02426, 1000=0.01906, 2500=0.01732, 5000=0.01594 (USD); Case/Package: 0603; Dielectric Material: Ceramic; Min Operating Temperature: -55°C; Max Operating Temperature: 125°C; Capacitance: 1uF; Tolerance: 10%; Packaging: Tape and Reel; Dielectric: X7R; Voltage Rating (DC): 16V; Length: 1.6mm; Depth: 0.8mm; ComponentLink1URL: http://www.farnell.com/datasheets/2747787.pdf?src-supplier=Farnell; ComponentLink1Description: http://www.farnell.com/datasheets/2747787.pdf?src-supplier=Farnell; ComponentLink2URL: http://components.arrow.com/part/dataview/0323_00313824?src-supplier=Arrow+Europe; ComponentLink2Description: http://components.arrow.com/part/dataview/0323_00313824?src-supplier=Arrow+Europe; ComponentLink3URL: http://www.farnell.com/datasheets/2747787.pdf?src-supplier=Newark; ComponentLink3Description: http://www.farnell.com/datasheets/2747787.pdf?src-supplier=Newark; ComponentLink4URL: http://www.farnell.com/datasheets/2747787.pdf?src-supplier=Element14; ComponentLink4Description: http://www.farnell.com/datasheets/2747787.pdf?src-supplier=Element14
C18 = GRM31CR60J107ME39L: 1206 100 uF 6.3 V ±20% Tolerance X5R SMT Multilayer Ceramic Capacitor
C19 = C0603C475K8PAC7411: Cap Ceramic 4.7uF 10V X5R 10% SMD 0603 85°C Paper T/R; Manufacturer: KEMET; Supplier 1: Digi-Key; Manufacturer Part Number: C0603C475K8PAC7411; RoHS: Yes; Category: Capacitors; Stock 1: 15372; Pricing 1: 1=0.31000, 10=0.21400, 50=0.14300, 100=0.12160, 500=0.08580, 1000=0.07508, 2500=0.07150, 5000=0.06614 (USD); Case/Package: 0603; Dielectric Material: Ceramic; Voltage Rating (DC): 10V; Dielectric: X5R; Tolerance: 10%; Capacitance: 4.7uF; Lead Free: Lead Free; RoHS Compliant: Yes
C22 = C0603C103K4REC7867: Cap Cer 0603 10NF 16V X7R 10%; Manufacturer: KEMET; Supplier 1: Digi-Key; Manufacturer Part Number: C0603C103K4REC7867; Stock 1: 7695; Pricing 1: 1=0.12000, 10=0.08800, 50=0.04820, 100=0.03930, 500=0.02810, 1000=0.02208 (USD)
FB1 = 74279266: WURTH ELEKTRONIK - 74279266 - Ferrite Bead, 0603 [1608 Metric], 1 kohm, 200 mA, WE-CBF Series, 0.6 ohm, ± 25%; Manufacturer: Wurth Electronics; Impedance: 1kR; Max DC Current: 200mA; DC Resistance (DCR): 600mR; Test Frequency: 100MHz; Number of Lines: 1; Inductance: 1.8nH; Shielding: Unshielded; Supplier 1: Digi-Key; Manufacturer Part Number: 74279266; RoHS: Yes; Category: Ferrite Beads and Chips; Stock 1: 78275; Pricing 1: 1=0.17000, 50=0.16800, 100=0.15500, 500=0.14800, 1000=0.14100, 2000=0.13400 (USD); Case/Package: SMD/SMT; Case Code (Metric): 1608; Case Code (Imperial): 0603; Core Material: Ferrite; Min Operating Temperature: -55°C; Max Operating Temperature: 125°C; Tolerance: 25%; Packaging: Tape and Reel; Termination: SMD/SMT; Max Current Rating: 200mA; Current Rating: 200mA; Series: WE-CBF; Length: 1.6mm; Width: 0.8mm; Height: 0.8mm; Depth: 0.8mm; Lead Free: Lead Free; REACH SVHC: Unknown; RoHS Compliant: Yes; ComponentLink1URL: https://datasheet.ciiva.com/14634/0900766b801ef1d0-14634816.pdf?src-supplier=Allied+Electronics; ComponentLink1Description: https://datasheet.ciiva.com/14634/0900766b801ef1d0-14634816.pdf?src-supplier=Allied+Electronics; ComponentLink2URL: https://datasheet.ciiva.com/23763/74279266-23763009.pdf?src-supplier=Newark; ComponentLink2Description: https://datasheet.ciiva.com/23763/74279266-23763009.pdf?src-supplier=Newark; ComponentLink3URL: https://datasheet.ciiva.com/11799/0900766b801ef1d0-11799352.pdf?src-supplier=RSComponents; ComponentLink3Description: https://datasheet.ciiva.com/11799/0900766b801ef1d0-11799352.pdf?src-supplier=RSComponents; ComponentLink4URL: https://datasheet.ciiva.com/14971/74279266-14971192.pdf?src-supplier=Digi-Key; ComponentLink4Description: https://datasheet.ciiva.com/14971/74279266-14971192.pdf?src-supplier=Digi-Key; ComponentLink5URL: https://datasheet.ciiva.com/12395/74279266-221135-12395453.pdf?src-supplier=Mouser; ComponentLink5Description: https://datasheet.ciiva.com/12395/74279266-221135-12395453.pdf?src-supplier=Mouser; ComponentLink6URL: https://datasheet.ciiva.com/1466/1705901-1466509.pdf?src-supplier=Element14; ComponentLink6Description: https://datasheet.ciiva.com/1466/1705901-1466509.pdf?src-supplier=Element14; ComponentLink7URL: https://datasheet.ciiva.com/22711/1705901-22711422.pdf?src-supplier=Element14; ComponentLink7Description: https://datasheet.ciiva.com/22711/1705901-22711422.pdf?src-supplier=Element14; ComponentLink8URL: https://datasheet.ciiva.com/48698/001087059-da-01-ml-we-cbf-smd-ferrit-74279266-de-en-48698427.pdf?src-supplier=Conrad; ComponentLink8Description: https://datasheet.ciiva.com/48698/001087059-da-01-ml-we-cbf-smd-ferrit-74279266-de-en-48698427.pdf?src-supplier=Conrad
J4 = FTSH-105-01-L-DV-K-TR: SAMTEC - FTSH-105-01-L-DV-K-TR - Pin Header, Wire-to-Board, 1.27 mm, 2 Rows, 10 Contacts, Surface Mount, FTSH Series; Number of Contacts: 10; Max Current Rating: 1.75A; Gender: Male; Connector Type: Male Pin; Row Spacing: 0.05inch; Supplier 1: Digi-Key; Manufacturer: Samtec; Manufacturer Part Number: FTSH-105-01-L-DV-K-TR; RoHS: Yes; Category: Headers and Wire Housings; Stock 1: 12516; Pricing 1: 1=3.28000, 10=3.14400, 100=2.62000 (USD); Mount: Surface Mount; Contact Plating: Gold; Contact Material: Bronze; Housing Color: Black; Housing Material: Polymer; Color: Black; Min Operating Temperature: -55°C; Max Operating Temperature: 125°C; Number of Rows: 2; Termination: Solder; Packaging: Tape and Reel; Orientation: Straight; Package Quantity: 550; Number of Positions: 10; Current Rating: 1.75A; Series: FTSH; Contact Type: Male Pin; Length: 6.35mm; Pitch: 1.27mm; Depth: 3.43mm; Contact Mating Length: 0.12inch; Radiation Hardening: No; Lead Free: Lead Free; RoHS Compliant: Yes; REACH SVHC: No SVHC; ComponentLink1URL: https://datasheet.ciiva.com/10245/ftsh-mt-10245289.pdf?src-supplier=Avnet; ComponentLink1Description: https://datasheet.ciiva.com/10245/ftsh-mt-10245289.pdf?src-supplier=Avnet; ComponentLink2URL: https://datasheet.ciiva.com/739/ftsh-1xx-xx-xxx-dv-xxx-mkt-739005.pdf?src-supplier=Digi-Key; ComponentLink2Description: https://datasheet.ciiva.com/739/ftsh-1xx-xx-xxx-dv-xxx-mkt-739005.pdf?src-supplier=Digi-Key; ComponentLink3URL: https://datasheet.ciiva.com/23735/81359-23735917.pdf?src-supplier=Newark; ComponentLink3Description: https://datasheet.ciiva.com/23735/81359-23735917.pdf?src-supplier=Newark
L3 = 744029004: Inductor, SMD Temperature range: -40 ... +125 °C Size: 2813: A/B/C/D/E = 2.8/2.8/1.35/0.9/0.9 mm Tolerance: ±30% Type...; Manufacturer: Wurth Electronics; Core Material: Ferrite; Self Resonant Frequency: 65MHz; Shielding: Shielded; Saturation Current: 800mA; DC Resistance (DCR): 200mR; Test Frequency: 100kHz; Max DC Current: 1.2A; Supplier 1: Digi-Key; Manufacturer Part Number: 744029004; RoHS: Yes; Category: Fixed Inductors; Stock 1: 14904; Pricing 1: 1=1.43000, 10=1.38900, 50=1.21500, 100=1.14600, 500=0.98000 (USD); Mount: Surface Mount; Case/Package: Nonstandard; Number of Pins: 2; Min Operating Temperature: -40°C; Max Operating Temperature: 125°C; Inductance: 4.7uH; Tolerance: 30%; Inductance Tolerance: 30%; Packaging: Cut Tape; Current Rating: 1A; Package Quantity: 1200; Resistor Type: Wirewound; Termination: SMD/SMT; RMS Current (Irms): 1A; Series Resistance: 200mR; Series: WE-TPC; Length: 2.8mm; Width: 2.8mm; Height: 1.35mm; Height - Seated (Max): 0.059inch; Depth: 2.8mm; REACH SVHC: Unknown; RoHS Compliant: Yes; ComponentLink1URL: https://datasheet.ciiva.com/11802/0900766b80d7f1cb-11802019.pdf?src-supplier=RSComponents; ComponentLink1Description: https://datasheet.ciiva.com/11802/0900766b80d7f1cb-11802019.pdf?src-supplier=RSComponents; ComponentLink2URL: https://datasheet.ciiva.com/1050/744029004-1050762.pdf?src-supplier=Digi-Key; ComponentLink2Description: https://datasheet.ciiva.com/1050/744029004-1050762.pdf?src-supplier=Digi-Key; ComponentLink3URL: https://datasheet.ciiva.com/4961/744029004-72684-4961071.pdf?src-supplier=Mouser; ComponentLink3Description: https://datasheet.ciiva.com/4961/744029004-72684-4961071.pdf?src-supplier=Mouser; ComponentLink4URL: https://datasheet.ciiva.com/22702/69358-22702629.pdf?src-supplier=Element14; ComponentLink4Description: https://datasheet.ciiva.com/22702/69358-22702629.pdf?src-supplier=Element14; ComponentLink5URL: https://datasheet.ciiva.com/1050/744029004-1050763.pdf?src-supplier=Digi-Key; ComponentLink5Description: https://datasheet.ciiva.com/1050/744029004-1050763.pdf?src-supplier=Digi-Key; ComponentLink6URL: https://datasheet.ciiva.com/1050/744029004-1050764.pdf?src-supplier=Digi-Key; ComponentLink6Description: https://datasheet.ciiva.com/1050/744029004-1050764.pdf?src-supplier=Digi-Key; ComponentLink7URL: https://datasheet.ciiva.com/14123/744029004-ch-ger-eng-ds-14123820.pdf?src-supplier=Distrelec; ComponentLink7Description: https://datasheet.ciiva.com/14123/744029004-ch-ger-eng-ds-14123820.pdf?src-supplier=Distrelec
R23 = RMCF0603JT1R00: Res Thick Film 0603 1 Ohm 5% 0.1W(1/10W) ±200ppm/C Molded SMD Paper T/R; Manufacturer: Stackpole Electronics; Resistance: 1R; Max Power Dissipation: 100mW; Temperature Coefficient: 200ppm/°C; Supplier 1: Digi-Key; Manufacturer Part Number: RMCF0603JT1R00; RoHS: Yes; Category: Chip SMD Resistors; Stock 1: 79282; Pricing 1: 1=0.10000, 10=0.02100, 100=0.00840, 1000=0.00379, 2500=0.00329 (USD); Mount: Surface Mount; Case/Package: 0603; Case Code (Metric): 1608; Case Code (Imperial): 0603; Contact Plating: Tin,Matte; Min Operating Temperature: -55°C; Max Operating Temperature: 155°C; Tolerance: 5%; Packaging: Tape and Reel; Resistor Type: Thick Film; Number of Terminations: 2; Features: Automotive AEC-Q200; Series: RMCF; Construction: Rectangular; Length: 0.061inch; Width: 0.031inch; Height: 0.022inch; Depth: 0.8mm; Radiation Hardening: No; Military Standard: Not; RoHS Compliant: Yes; ComponentLink1URL: http://components.arrow.com/part/dataview/47073886S9848743N1174?src-supplier=Arrow+Electronics; ComponentLink1Description: http://components.arrow.com/part/dataview/47073886S9848743N1174?src-supplier=Arrow+Electronics; ComponentLink2URL: https://www.seielect.com/catalog/SEI-RMCF_RMCP.pdf?src-supplier=Avnet; ComponentLink2Description: https://www.seielect.com/catalog/SEI-RMCF_RMCP.pdf?src-supplier=Avnet; ComponentLink3URL: https://www.seielect.com/Catalog/SEI-RMCF_RMCP.pdf?src-supplier=Digi-Key; ComponentLink3Description: https://www.seielect.com/Catalog/SEI-RMCF_RMCP.pdf?src-supplier=Digi-Key; ComponentLink4URL: https://www.seielect.com/catalog/SEI-Packaging.pdf?src-supplier=Digi-Key; ComponentLink4Description: https://www.seielect.com/catalog/SEI-Packaging.pdf?src-supplier=Digi-Key
R24 = RMCF0805FT10K0: as R21 on sheet Sheet4_MCU_Sensors; Supplier 1: Digi-Key; Manufacturer Part Number: RMCF0805FT10K0; RoHS: Yes; Category: Chip SMD Resistors; Stock 1: 2466676; Pricing 1: 1=0.10000, 10=0.02600, 100=0.01040, 1000=0.00466, 2500=0.00405 (USD); Mount: Surface Mount; Case/Package: 0805; Case Code (Metric): 2012; Case Code (Imperial): 0805; Contact Plating: Tin,Matte; Size Code: 0805; Min Operating Temperature: -55°C; Max Operating Temperature: 155°C; Tolerance: 1%; Packaging: Tape and Reel; Resistor Type: Thick Film; Number of Terminations: 2; Max Power Dissipation: 125mW; Features: Automotive AEC-Q200; Series: RMCF; Construction: Rectangular; Length: 2mm; Width: 0.049inch; Height: 0.026inch; Depth: 1.25mm; Radiation Hardening: No; Lead Free: Lead Free; Military Standard: Not; RoHS Compliant: Yes; ComponentLink1URL: https://datasheet.ciiva.com/15193/getdatasheetpartid-362046-15193525.pdf?src-supplier=Verical; ComponentLink1Description: https://datasheet.ciiva.com/15193/getdatasheetpartid-362046-15193525.pdf?src-supplier=Verical
Rst1 = PTS647SK38SMTR2LFS: Switch Tactile N.O. SPST Round Button Gull Wing 0.05A 12VDC 100000Cycles 2.45N SMD T/R; Manufacturer: ITT C&K; Illumination Type: Non-Illuminated; Switch Function: Off-Mom; Actuator Type: Standard; Operating Force: 250gf; Switch Travel: 0.25mm; Ratings: IP40; Supplier 1: Digi-Key; Manufacturer Part Number: PTS647SK38SMTR2LFS; RoHS: No; Category: Tactile Switches; Stock 1: 62118; Pricing 1: 1=0.13000, 10=0.12700, 25=0.12080, 100=0.10970, 250=0.10308, 500=0.09432, 1000=0.07897 (USD); Mount: Surface Mount; Mechanical Life: 100000Cycles; Min Operating Temperature: -20°C; Max Operating Temperature: 70°C; Throw Configuration: SPST; Packaging: Tape and Reel; Termination: Gull Wing; ComponentLink1URL: https://www.ckswitches.com/media/2567/pts647.pdf?src-supplier=Digi-Key; ComponentLink1Description: https://www.ckswitches.com/media/2567/pts647.pdf?src-supplier=Digi-Key
U3 = EFR32BG13P732F512GM48-B_1: as U3 on sheet Sheet4_MCU_Sensors; Supplier 1: Digi-Key; Manufacturer Part Number: EFR32BG13P732F512GM48-B; RoHS: Yes; Category: RF Receivers, Transceivers; Stock 1: 19; Pricing 1: 1=6.48000, 25=6.24040, 100=6.00030, 1000=5.98905 (USD); Min Operating Temperature: -40°C; Max Operating Temperature: 85°C; Packaging: Tray; RoHS Compliant: Yes; ComponentLink1URL: https://www.silabs.com/documents/login/data-sheets/efr32bg13-datasheet.pdf?src-supplier=Digi-Key; ComponentLink1Description: https://www.silabs.com/documents/login/data-sheets/efr32bg13-datasheet.pdf?src-supplier=Digi-Key